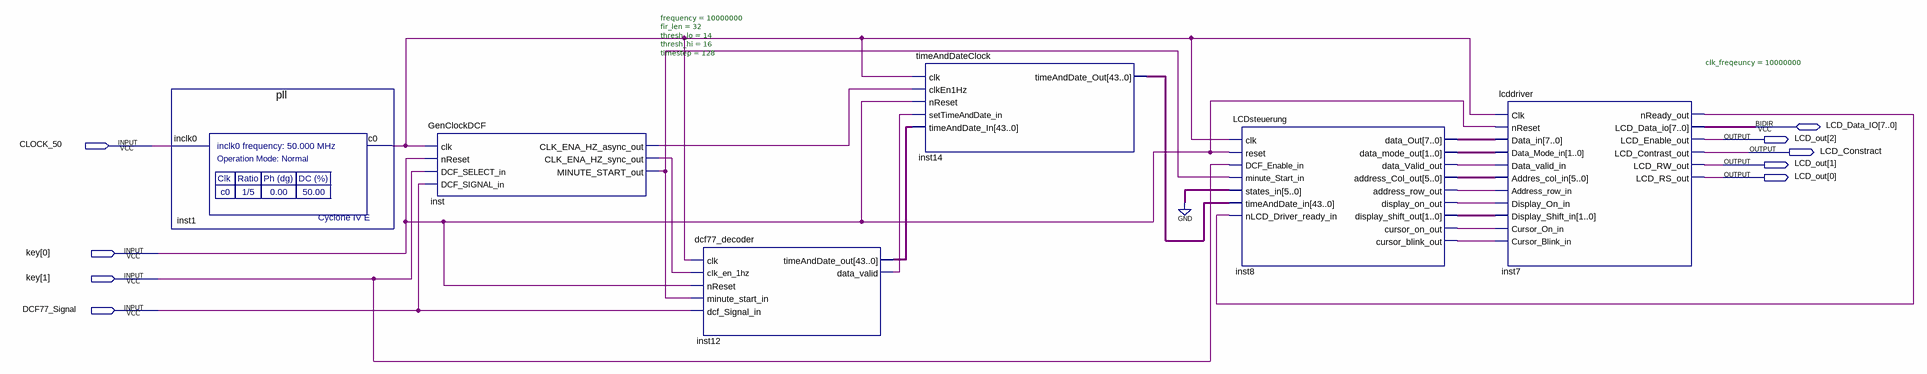
[diagram p0: schematic sheet]
// Quartus schematic my_first_fpga.bdf as structural Verilog: 6 symbols, 9 pins
module my_first_fpga (
  input  CLOCK_50,
  input  [1:0] key,
  input  DCF77_Signal,
  inout  [7:0] LCD_Data_IO,
  output [2:0] LCD_out,
  output LCD_Constract
);

  wire inst1_c0, inst7_nready_out, inst8_address_row_out, inst8_cursor_blink_out, inst8_cursor_on_out,
       inst8_data_valid_out, inst8_display_on_out, inst12_data_valid, inst_clk_ena_hz_async_out,
       inst_clk_ena_hz_sync_out, inst_minute_start_out;
  wire [1:0] inst8_data_mode_out, inst8_display_shift_out;
  wire [5:0] inst8_address_col_out;
  wire [7:0] inst8_data_out;
  wire [43:0] inst12_timeanddate_out, inst14_timeanddate_out;

  pll inst1 (.inclk0(CLOCK_50), .c0(inst1_c0));
  GenClockDCF #(.frequency(10000000), .fir_len(32), .thresh_lo(14), .thresh_hi(16), .timestep(128)) inst (
    .clk(inst1_c0), .nReset(key[0]), .DCF_SELECT_in(key[1]), .DCF_SIGNAL_in(DCF77_Signal),
    .CLK_ENA_HZ_async_out(inst_clk_ena_hz_async_out), .CLK_ENA_HZ_sync_out(inst_clk_ena_hz_sync_out),
    .MINUTE_START_out(inst_minute_start_out));
  dcf77_decoder inst12 (
    .clk(inst1_c0), .clk_en_1hz(inst_clk_ena_hz_sync_out), .nReset(key[0]),
    .minute_start_in(inst_minute_start_out), .dcf_Signal_in(DCF77_Signal),
    .timeAndDate_out(inst12_timeanddate_out), .data_valid(inst12_data_valid));
  timeAndDateClock inst14 (
    .clk(inst1_c0), .clkEn1Hz(inst_clk_ena_hz_async_out), .nReset(key[0]),
    .setTimeAndDate_in(inst12_data_valid), .timeAndDate_In(inst12_timeanddate_out),
    .timeAndDate_Out(inst14_timeanddate_out));
  LCDsteuerung inst8 (
    .clk(inst1_c0), .reset(key[0]), .DCF_Enable_in(key[1]), .minute_Start_in(inst_minute_start_out),
    .states_in({6{1'b0}}), .timeAndDate_in(inst14_timeanddate_out), .nLCD_Driver_ready_in(inst7_nready_out),
    .data_Out(inst8_data_out), .data_mode_out(inst8_data_mode_out), .data_Valid_out(inst8_data_valid_out),
    .address_Col_out(inst8_address_col_out), .address_row_out(inst8_address_row_out),
    .display_on_out(inst8_display_on_out), .display_shift_out(inst8_display_shift_out),
    .cursor_on_out(inst8_cursor_on_out), .cursor_blink_out(inst8_cursor_blink_out));
  lcddriver #(.clk_freqeuncy(10000000)) inst7 (
    .Clk(inst1_c0), .nReset(key[0]), .Data_in(inst8_data_out), .Data_Mode_in(inst8_data_mode_out),
    .Data_valid_in(inst8_data_valid_out), .Addres_col_in(inst8_address_col_out),
    .Address_row_in(inst8_address_row_out), .Display_On_in(inst8_display_on_out),
    .Display_Shift_in(inst8_display_shift_out), .Cursor_On_in(inst8_cursor_on_out),
    .Cursor_Blink_in(inst8_cursor_blink_out), .nReady_out(inst7_nready_out), .LCD_Enable_out(LCD_out[2]),
    .LCD_Contrast_out(LCD_Constract), .LCD_RW_out(LCD_out[1]), .LCD_RS_out(LCD_out[0]),
    .LCD_Data_io(LCD_Data_IO));
endmodule
